# Altium schematic sheet Display.SchDoc: Display
size 420 x 297 mm; DocumentNumber: 8; SheetNumber: 8; SheetTotal: 8
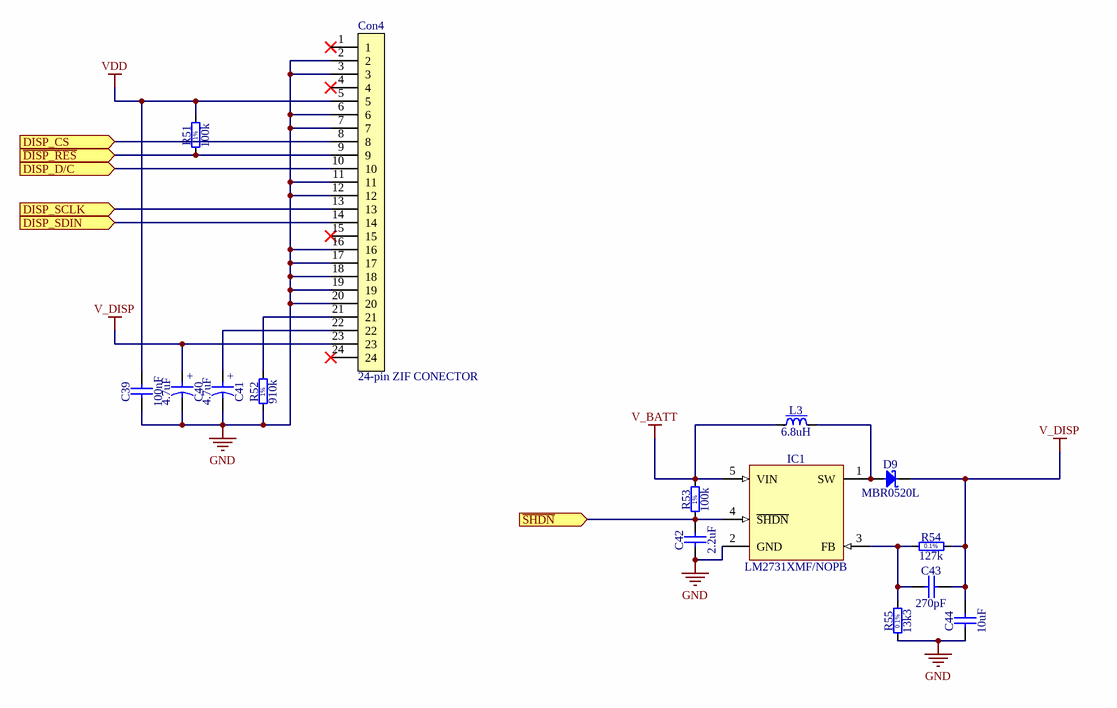
[diagram p0: Display.SchDoc]

## Parts
C39  100nF  [CAPC1608X87N]
C40  4.7uF  [CAPMP3216X180N]
C41  4.7uF  [CAPMP3216X180N]
C42  2.2uF  [CAPC1608X90N]
C43  270pF  [CAPC1608X87N]
C44  10uF  [CAPC1608X87N]
Con4  24-pin ZIF CONECTOR  [CviLux CF20 ZIFNZ0224CV]
D9  MBR0520L  [SOD3816X118N]
IC1  LM2731XMF/NOPB  [SOT95P284X122-5N]
L3  6.8uH  [IND_COILCRAFT_DO3316]
R51  100k  [RESC1608X55N]
R52  910k  [RESC1608X55N]
R53  100k  [RESC1608X55N]
R54  127k  [RESC1608X55N]
R55  13k3  [RESC1608X55N]

## Ports
DISP_CS (in), DISP_D/C (in), DISP_SCLK (in), DISP_SDIN (in), ~{DISP_RES} (in), ~{SHDN} (in)

## Nets
GND: C39.1 C40.2 C41.2 C42.1 C44.1 Con4.2 Con4.3 Con4.6 Con4.7 Con4.11 Con4.12 Con4.16 Con4.17 Con4.18 Con4.19 Con4.20 IC1.2(GND) R52.1 R55.1
V_BATT: IC1.5(VIN) L3.1 R53.2
V_DISP: C40.1 C43.2 C44.2 Con4.23 D9.1(C) R54.2
VDD: C39.2 Con4.5 R51.2
~{DISP_RES}: Con4.9 R51.1 ; port ~{DISP_RES}
DISP_CS: Con4.8 ; port DISP_CS
DISP_D/C: Con4.10 ; port DISP_D/C
DISP_SCLK: Con4.13 ; port DISP_SCLK
DISP_SDIN: Con4.14 ; port DISP_SDIN
~{SHDN}: C42.2 IC1.4(~{SHDN}) R53.1 ; port ~{SHDN}
NetC41_1: C41.1 Con4.22
NetC43_1: C43.1 IC1.3(FB) R54.1 R55.2
NetCon4_21: Con4.21 R52.2
NetD9_2: D9.2(A) IC1.1(SW) L3.2

Not connected (* = marked no-connect by the designer): Con4 1* 4* 15* 24*

## Notes on the sheet
- Project/Equipment
- Document
- Sensorbox
- Designer
- Drawn by
- Check.by
- Copyright Creotech Instruments SA 2014.
  This documentation describes Open Hardware and is licensed under the CERN OHL v.1.1. You may redistribute and modify this documentation under the terms of the CERN OHL v.1.1. (http://ohwr.org/CERNOHL). This documentation is distributed WITHOUT ANY EXPRESS OR IMPLIED WARRANTY, INCLUDING OF MERCHANTABILITY, SATISFACTORY QUALITY AND FITNESS FOR A PARTICULAR PURPOSE. Please see the CERN OHL v.1.1 for applicable conditions.
- CTI
- Creotech Instruments S.A.
- File
- Last Mod.
- Print Date
- Sheet
- Size
- A3
- of
- Rev
- (in symbol CTE3216-18_4.7UF_10V_10%_LESR1400) +
- (in symbol R0603_13K3_0.1%_0.063W_10PPM) 0.1%
- (in symbol R0603_100K_1%_0.1W_100PPM) 1%
- (in symbol R0603_127K_0.1%_0.063W_10PPM) 0.1%
- (in symbol R0603_910K_1%_0.1W_100PPM) 1%

## Library data of the parts
C39 = CC0603_100NF_50V_10%_X7R: Non-polarised capacitor; Part Description: SMD Multilayer Chip Ceramic Capacitor; Manufacturer: GENERIC; Manufacturer1 Part Number: 223858615649; Voltage: 50V; TC: X7R; Tolerance: ±10%; Table: Capacitors SMD; Part Number: CC0603_100NF_50V_10%_X7R; Component Kind: Standard; Component Type: Standard; Pin Count: 2; Value: 100nF; Status: Preferred; Manufacturer Part Number: CC0603_100NF_50V_10%_X7R; Case: 0603; Mounted: Yes; Socket: No; SMD: Yes; Manufacturer1 Example: PHYCOMP; Manufacturer1 ComponentHeight: 0.87mm; HelpURL: \\cern.ch\dfs\Applications\Altium\Datasheets\CC0603_X7R_PHYCOMP.pdf; Author: CERN DEM JLC; CreateDate: 2007-12-03; LatestRevisionDate: 2007-12-03
C40 C41 = CTE3216-18_4.7UF_10V_10%_LESR1400: Polarised capacitor; Part Number: 4.7UF_16V_10%_LESR1400; Part Description: Low ESR 1R4 Solid Tantalum Chip Capacitor; Manufacturer: GENERIC; Manufacturer1 Part Number: TPSA475K010R1400; Voltage: 16V; Tolerance: ±10%; Table: Capacitors SMD; Component Kind: Standard; Component Type: Standard; Pin Count: 2; Value: 4.7uF; Status: Preferred; Manufacturer Part Number: 4.7UF_16V_10%_LESR1400; Case: A; Mounted: Yes; Socket: No; SMD: Yes; Manufacturer1 Example: AVX; Manufacturer1 ComponentHeight: 1.8mm; HelpURL: \\cern.ch\dfs\Applications\Altium\Datasheets\CTE-LESR_AVX_TPS.pdf; Author: CERN DEM JLC; CreateDate: 2008-05-05; LatestRevisionDate: 2009-01-20
C42 = CC0603_2.2UF_10V_20%_X7R: Non-polarised capacitor; Part Description: SMD Multilayer Chip Ceramic Capacitor; Manufacturer: GENERIC; Manufacturer1 Part Number: LMK107B7225MA-T; Voltage: 10V; TC: X7R; Tolerance: ±20%; Table: Capacitors SMD; Part Number: CC0603_2.2UF_10V_20%_X7R; Component Kind: Standard; Component Type: Standard; Pin Count: 2; Value: 2.2uF; Status: Not Recommended; Manufacturer Part Number: CC0603_2.2UF_10V_20%_X7R; Case: 0603; Mounted: Yes; Socket: No; SMD: Yes; Manufacturer1 Example: TAIYO YUDEN; Manufacturer1 ComponentHeight: 0.9mm; HelpURL: \\cern.ch\dfs\Applications\Altium\Datasheets\CC0603_X7R_TAIYO-YUDEN_HIGH-VALUE.pdf; Author: CERN DEM JLC; CreateDate: 2011-06-22; LatestRevisionDate: 2011-06-27
C43 = CC0603_270PF_50V_5%_NP0: Non-polarised capacitor; Part Description: SMD Multilayer Chip Ceramic Capacitor; Manufacturer: GENERIC; Manufacturer1 Part Number: 223886715271; Voltage: 50V; TC: NP0; Tolerance: ±5%; Table: Capacitors SMD; Part Number: CC0603_270PF_50V_5%_NP0; Component Kind: Standard; Component Type: Standard; Pin Count: 2; Value: 270pF; Status: Preferred; Manufacturer Part Number: CC0603_270PF_50V_5%_NP0; Case: 0603; Mounted: Yes; Socket: No; SMD: Yes; Manufacturer1 Example: PHYCOMP; Manufacturer1 ComponentHeight: 0.87mm; HelpURL: \\cern.ch\dfs\Applications\Altium\Datasheets\CC0603_NP0_PHYCOMP.pdf; Author: CERN DEM JLC; CreateDate: 2007-12-03; LatestRevisionDate: 2007-12-03
C44 = CC0603_10UF_6.3V_20%_X5R: Non-polarised capacitor; Part Description: SMD Multilayer Chip Ceramic Capacitor; Manufacturer: GENERIC; Manufacturer1 Part Number: C0603C106M9PAC; Voltage: 6.3V; TC: X5R; Tolerance: ±20%; Table: Capacitors SMD; Part Number: CC0603_10UF_6.3V_20%_X5R; Component Kind: Standard; Component Type: Standard; Pin Count: 2; Value: 10uF; Status: Preferred; Manufacturer Part Number: CC0603_10uF_6.3V_20%_X5R; Case: 0603; Mounted: Yes; Socket: No; SMD: Yes; Manufacturer1 Example: KEMET; Manufacturer1 ComponentHeight: 0.95mm; HelpURL: \\cern.ch\dfs\Applications\Altium\Datasheets\CC0603_X5R_KEMET.pdf; Author: CERN DEM JLC; CreateDate: 2007-12-03; LatestRevisionDate: 2007-12-03
Con4 = ZIFNZ0224CV CviLux CF20: 24-pin ZIF Male Down Side Connector
D9 = MBR0520L: Schottky Diode; Part Description: Schottky Power Rectifier; Manufacturer: FAIRCHILD SEMICONDUCTOR; Voltage: 20V; Power: 0.5A; Table: Diodes; Part Number: MBR0520L; Component Kind: Standard; Component Type: Standard; Device: MBR0520L; PackageDescription: SOD Diode (SOD-123); 2.70mm W X 1.60mm L X 1.18mm H body, IPC Medium Density; Manufacturer Part Number: MBR0520L; Pin Count: 2; Case: SOD-123; Mounted: Yes; Socket: No; SMD: Yes; ComponentHeight: 1.18mm; HelpURL: \\cern.ch\dfs\Applications\Altium\Datasheets\MBR0520L.pdf; Author: CERN DEM JLC; CreateDate: 2009-11-25; LatestRevisionDate: 2009-11-25
IC1 = LM2731YMF/NOPB: 0.0.6MHz Boost Converters With 22V Internal FET Switch; Part Description: 2.7V-14V, 1.8A, 0.6MHz Boost Converters With 22V Internal FET Switch; Manufacturer: NATIONAL SEMICONDUCTOR; Table: Regulators; Part Number: LM2731XMF/NOPB; Component Kind: Standard; Component Type: Standard; Device: LM2731XMF/NOPB; PackageDescription: SOT23 5, Pitch 0.95mm - Body 1.67x2.99mm, IPC Medium Density; Manufacturer Part Number: LM2731YMF/NOPB; Pin Count: 5; Case: SOT23-5; Mounted: Yes; Socket: No; SMD: Yes; ComponentHeight: 1.19mm; HelpURL: \\cern.ch\dfs\Applications\Altium\Datasheets\LM2731YMF-NOPB.pdf; Author: CERN DEM JLC; CreateDate: 2011-09-26; LatestRevisionDate: 2011-09-26
L3 = IND_6.8UH_20%_COILCRAFT_DO3316P-682MLD: Inductor With Magnetic core; Part Description: SMT Power Inductors; Power: 4.4A; Resistance: 0.027R; Tolerance: ±20%; Table: Inductors SMD; Part Number: IND_6.8UH_20%_COILCRAFT_DO3316P-682MLD; Component Kind: Standard; Component Type: Standard; Pin Count: 2; Value: 6.8uH; Status: None; Manufacturer: COILCRAFT; Manufacturer Part Number: DO3316P-682MLD; Mounted: Yes; Socket: No; SMD: Yes; ComponentHeight: 5.21mm; HelpURL: \\cern.ch\dfs\Applications\Altium\Datasheets\IND_COILCRAFT_DO3316P.pdf; Author: CERN DEM JLC; CreateDate: 2008-06-26; LatestRevisionDate: 2010-02-17
R51 R53 = R0603_100K_1%_0.1W_100PPM: Resistor - 1%; Part Description: General Purpose Thick Film Chip Resistor; Manufacturer: GENERIC; Manufacturer1 Part Number: NRC06F1003TRF; Power: 0.1W; TC: ±100ppm/°C; Table: Resistors SMD; Part Number: R0603_100K_1%_0.1W_100PPM; Component Kind: Standard; Component Type: Standard; Pin Count: 2; Value: 100k; Status: Preferred; Tolerance: ±1%; Manufacturer Part Number: R0603_100K_1%_0.1W_100PPM; Case: 0603; Mounted: Yes; Socket: No; SMD: Yes; Manufacturer1 Example: NIC COMPONENT; Manufacturer1 ComponentHeight: 0.55mm; HelpURL: \\cern.ch\dfs\Applications\Altium\Datasheets\R0603_NIC_NRC.pdf; Author: CERN DEM JLC; CreateDate: 2007-12-03; LatestRevisionDate: 2008-03-13
R52 = R0603_910K_1%_0.1W_100PPM: Resistor - 1%; Part Description: General Purpose Thick Film Chip Resistor; Manufacturer: GENERIC; Manufacturer1 Part Number: NRC06F9103TRF; Power: 0.1W; TC: ±100ppm/°C; Table: Resistors SMD; Part Number: R0603_910K_1%_0.1W_100PPM; Component Kind: Standard; Component Type: Standard; Pin Count: 2; Value: 910k; Status: Preferred; Tolerance: ±1%; Manufacturer Part Number: R0603_910K_1%_0.1W_100PPM; Case: 0603; Mounted: Yes; Socket: No; SMD: Yes; Manufacturer1 Example: NIC COMPONENT; Manufacturer1 ComponentHeight: 0.55mm; HelpURL: \\cern.ch\dfs\Applications\Altium\Datasheets\R0603_NIC_NRC.pdf; Author: CERN DEM JLC; CreateDate: 2007-12-03; LatestRevisionDate: 2008-03-13
R54 = R0603_127K_0.1%_0.063W_10PPM: Resistor - 0.1%; Part Description: Thin Film Chip Resistor; Manufacturer: GENERIC; Manufacturer1 Part Number: RN73C1J127KBTDF; Power: 0.063W; TC: ±10ppm; Table: Resistors SMD; Part Number: R0603_127K_0.1%_0.063W_10PPM; Component Kind: Standard; Component Type: Standard; Pin Count: 2; Value: 127k; Status: Not recommended; Tolerance: ±0.1%; Manufacturer Part Number: R0603_127K_0.1%_0.063W_10PPM; Case: 0603; Mounted: Yes; Socket: No; SMD: Yes; Manufacturer1 Example: TYCO HOLSWORTHY; Manufacturer1 ComponentHeight: 0.5mm; HelpURL: \\cern.ch\dfs\Applications\Altium\Datasheets\R0603_Tyco_RN73.pdf; Author: CERN DEM JLC; CreateDate: 2007-12-03; LatestRevisionDate: 2008-03-13
R55 = R0603_13K3_0.1%_0.063W_10PPM: Resistor - 0.1%; Part Description: Thin Film Chip Resistor; Manufacturer: GENERIC; Manufacturer1 Part Number: RN73C1J13K3BTDF; Power: 0.063W; TC: ±10ppm; Table: Resistors SMD; Part Number: R0603_13K3_0.1%_0.063W_10PPM; Component Kind: Standard; Component Type: Standard; Pin Count: 2; Value: 13k3; Status: Not recommended; Tolerance: ±0.1%; Manufacturer Part Number: R0603_13K3_0.1%_0.063W_10PPM; Case: 0603; Mounted: Yes; Socket: No; SMD: Yes; Manufacturer1 Example: TYCO HOLSWORTHY; Manufacturer1 ComponentHeight: 0.5mm; HelpURL: \\cern.ch\dfs\Applications\Altium\Datasheets\R0603_Tyco_RN73.pdf; Author: CERN DEM JLC; CreateDate: 2007-12-03; LatestRevisionDate: 2008-03-13